# Altium project FPGA_Dev_Board.PrjPcb
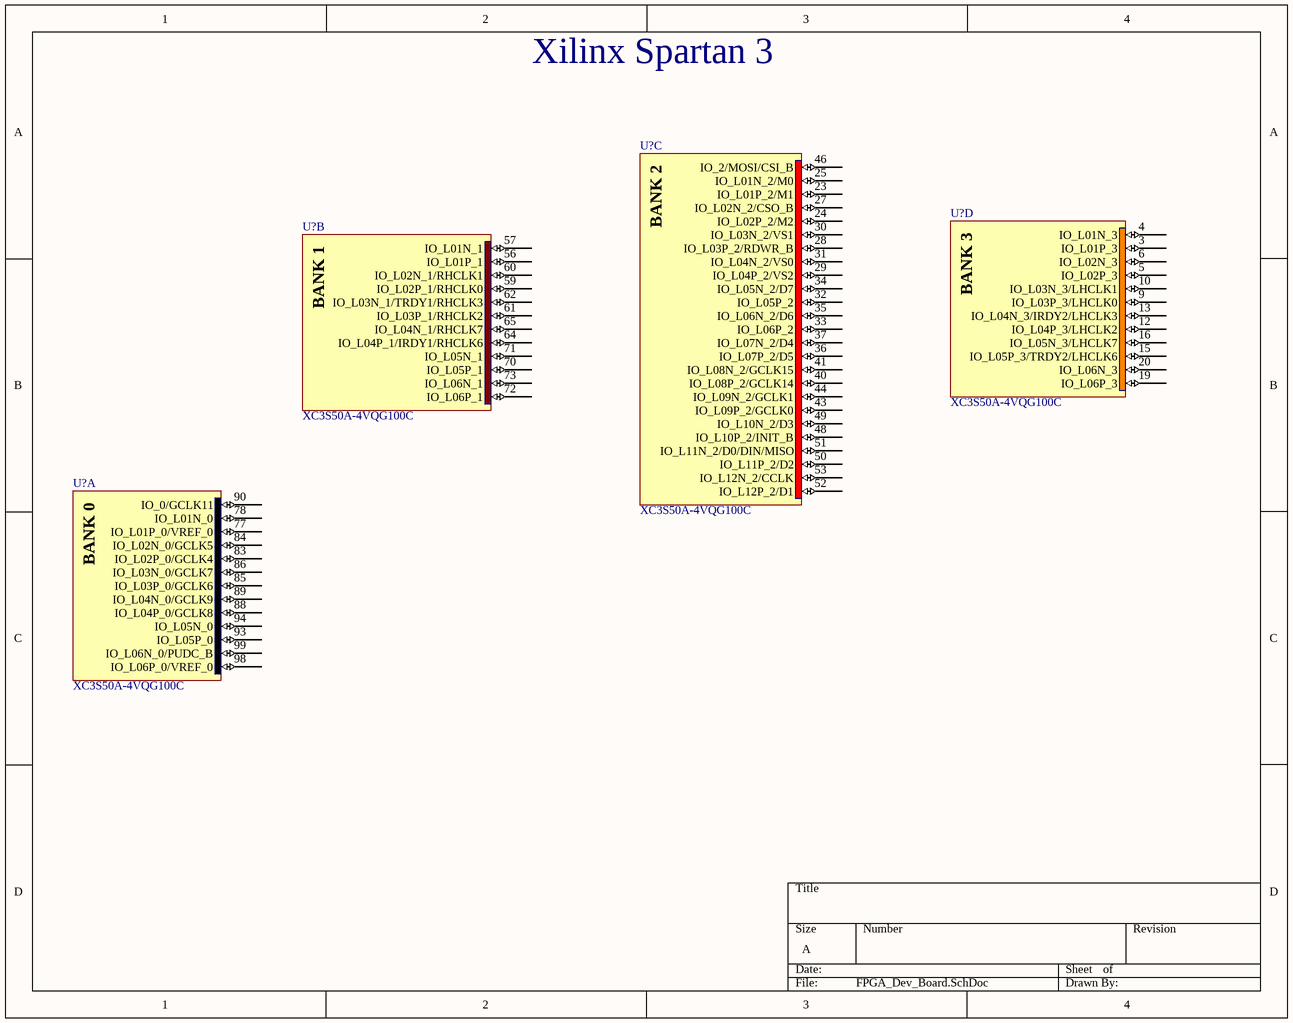
[diagram p0: FPGA_Dev_Board.SchDoc]
7 sheets, 34 parts. Net scope: global (net labels, ports and power ports of the same name join across sheets).
Sheets:
  Block Diagram.SchDoc
  FPGA_Dev_Board.SchDoc
  Peripherals.SchDoc
  SPI Flash.SchDoc
  PMICs.SchDoc
  Sensors.SchDoc
  DRAM.SchDoc

## Sheet Block Diagram.SchDoc
size A; SheetNumber: 1; SheetTotal: 8

## Sheet FPGA_Dev_Board.SchDoc
size A; SheetNumber: 2; SheetTotal: 8

### Parts
(Parts that share a designator on the sheet are numbered #1, #2 ... from top to bottom, then left to right.)
U?#1  XC3S50A-4VQG100C  [VQG100_N]  (part C of 8)
U?#2  XC3S50A-4VQG100C  [VQG100_N]  (part D of 8)
U?#3  XC3S50A-4VQG100C  [VQG100_N]  (part B of 8)
U?#4  XC3S50A-4VQG100C  [VQG100_N]  (part A of 8)

### Nets

Not connected (* = marked no-connect by the designer): U?#1 23(IO_L01P_2/M1) 24(IO_L02P_2/M2) 25(IO_L01N_2/M0) 27(IO_L02N_2/CSO_B) 28(IO_L03P_2/RDWR_B) 29(IO_L04P_2/VS2) 30(IO_L03N_2/VS1) 31(IO_L04N_2/VS0) 32(IO_L05P_2) 33(IO_L06P_2) 34(IO_L05N_2/D7) 35(IO_L06N_2/D6) 36(IO_L07P_2/D5) 37(IO_L07N_2/D4) 40(IO_L08P_2/GCLK14) 41(IO_L08N_2/GCLK15) 43(IO_L09P_2/GCLK0) 44(IO_L09N_2/GCLK1) 46(IO_2/MOSI/CSI_B) 48(IO_L10P_2/INIT_B) 49(IO_L10N_2/D3) 50(IO_L11P_2/D2) 51(IO_L11N_2/D0/DIN/MISO) 52(IO_L12P_2/D1) 53(IO_L12N_2/CCLK); U?#2 3(IO_L01P_3) 4(IO_L01N_3) 5(IO_L02P_3) 6(IO_L02N_3) 9(IO_L03P_3/LHCLK0) 10(IO_L03N_3/LHCLK1) 12(IO_L04P_3/LHCLK2) 13(IO_L04N_3/IRDY2/LHCLK3) 15(IO_L05P_3/TRDY2/LHCLK6) 16(IO_L05N_3/LHCLK7) 19(IO_L06P_3) 20(IO_L06N_3); U?#3 56(IO_L01P_1) 57(IO_L01N_1) 59(IO_L02P_1/RHCLK0) 60(IO_L02N_1/RHCLK1) 61(IO_L03P_1/RHCLK2) 62(IO_L03N_1/TRDY1/RHCLK3) 64(IO_L04P_1/IRDY1/RHCLK6) 65(IO_L04N_1/RHCLK7) 70(IO_L05P_1) 71(IO_L05N_1) 72(IO_L06P_1) 73(IO_L06N_1); U?#4 77(IO_L01P_0/VREF_0) 78(IO_L01N_0) 83(IO_L02P_0/GCLK4) 84(IO_L02N_0/GCLK5) 85(IO_L03P_0/GCLK6) 86(IO_L03N_0/GCLK7) 88(IO_L04P_0/GCLK8) 89(IO_L04N_0/GCLK9) 90(IO_0/GCLK11) 93(IO_L05P_0) 94(IO_L05N_0) 98(IO_L06P_0/VREF_0) 99(IO_L06N_0/PUDC_B)

### Notes on the sheet
- Xilinx Spartan 3
- (in symbol CMP-0049-00079-1, part A) BANK 0
- (in symbol CMP-0049-00079-1, part B) BANK 1
- (in symbol CMP-0049-00079-1, part C) BANK 2
- (in symbol CMP-0049-00079-1, part D) BANK 3

### Library data of the parts
U?#1-U?#4 = CMP-0049-00079-1: Spartan-3A I/O Optimized FPGA, 68 User I/Os, 100-Pin VQFP, Standard Performance, Commercial Grade, Pb-Free; PackageReference: VQG100; DatasheetVersion: ver1.8, Mar-2009; PackageDescription: 100-Pin Very Thin Quad Flat Pack (VQG100) - Pb-Free; PackageVersion: ver1.2.1, Feb-2007; Code_JEDEC: MS-026-AED

## Sheet Peripherals.SchDoc
size A; SheetNumber: 4; SheetTotal: 8

## Sheet SPI Flash.SchDoc
size A; SheetNumber: 4; SheetTotal: 7
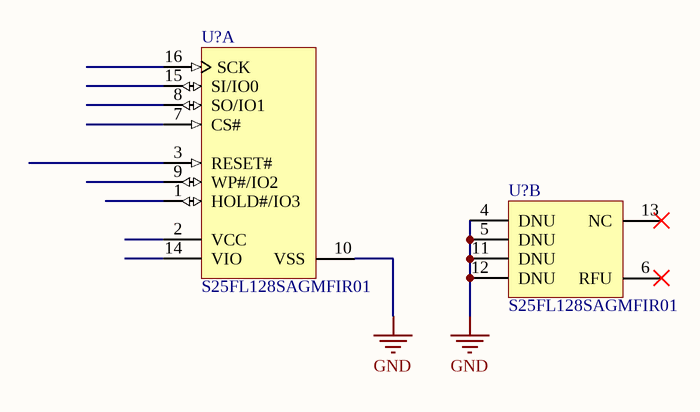
[diagram p1: SPI Flash.SchDoc]

### Parts
(Parts that share a designator on the sheet are numbered #1, #2 ... from top to bottom, then left to right.)
U?#5  S25FL128SAGMFIR01  [SPSN-SOIC-16_N]  (part A of 2)
U?#6  S25FL128SAGMFIR01  [SPSN-SOIC-16_N]  (part B of 2)

### Nets
GND: U?#5.10(VSS) U?#6.4(DNU) U?#6.5(DNU) U?#6.11(DNU) U?#6.12(DNU)

Not connected (* = marked no-connect by the designer): U?#5 1(HOLD#/IO3) 2(VCC) 3(RESET#) 7(CS#) 8(SO/IO1) 9(WP#/IO2) 14(VIO) 15(SI/IO0) 16(SCK); U?#6 6(RFU)* 13(NC)*

### Library data of the parts
U?#5 U?#6 = CMP-1329-00021-1: MirrorBit Flash Non-Volatile Memory CMOS 3.0 Volt Core with Versatile I/O, Serial Peripheral Interface with Multi-I/O, 128 Mbit, 133 MHz, -40 to 85 degC, 16-Pin SO (SO3016), RoHS, Tube; Manufacturer: Spansion; OTP: 1024 B; VCC: 2.7 to 3.6 V; Speed: 133 MHz; PackageDescription: 16-Pin Wide Plastic Small Outline Package, Body 10.3 x 7.5 mm, Pitch 1.27 mm; ComponentLink2URL: http://www.spansion.com/Support/Datasheets/S25FL128S_256S_00.pdf; PartNumber: S25FL128SAGMFIR01; Packing: Tube; Density: 128 Mbit; Temperature Range: -40 to 85 degC; Mounting Technology: Surface Mount; RoHS: TRUE; DatasheetVersion: Rev. 08; ComponentLink2Description: Datasheet; ComponentLink3URL: http://www.spansion.com/Support/Datasheets/S25FL128S_256S_00.pdf; ComponentLink1Description: Manufacturer URL; ComponentLink1URL: http://www.spansion.com/Pages/Default.aspx; ComponentLink3Description: Package Specification

## Sheet PMICs.SchDoc
size A; SheetNumber: 5; SheetTotal: 7
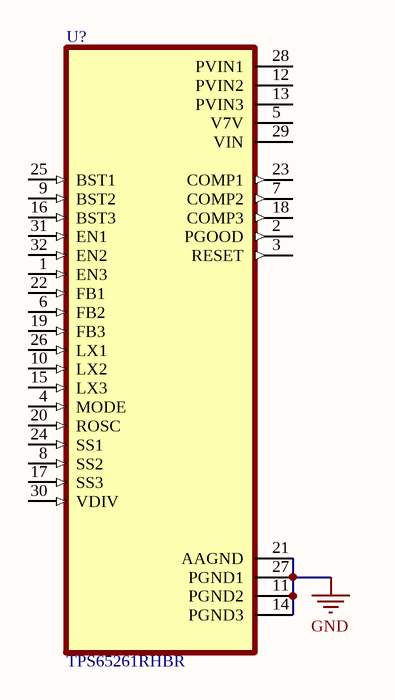
[diagram p2: PMICs.SchDoc]

### Parts
(Parts that share a designator on the sheet are numbered #1, #2 ... from top to bottom, then left to right.)
U?#7  TPS65261RHBR  [IC_ADS125H01IRHBT]

### Nets
GND: U?#7.11(PGND2) U?#7.14(PGND3) U?#7.21(AAGND) U?#7.27(PGND1)

Not connected (* = marked no-connect by the designer): U?#7 1(EN3) 2(PGOOD) 3(RESET) 4(MODE) 5(V7V) 6(FB2) 7(COMP2) 8(SS2) 9(BST2) 10(LX2) 12(PVIN2) 13(PVIN3) 15(LX3) 16(BST3) 17(SS3) 18(COMP3) 19(FB3) 20(ROSC) 22(FB1) 23(COMP1) 24(SS1) 25(BST1) 26(LX1) 28(PVIN1) 29(VIN) 30(VDIV) 31(EN1) 32(EN2)

### Library data of the parts
U?#7 = TPS65261RHBR: 4.5V to 18V Input Voltage, 3A/2A/2A Output Current Triple Synchronous Buck Converter 32-VQFN -40 to 85; MF: Texas Instruments; MP: TPS65261RHBR; Purchase-URL: https://pricing.snapeda.com/search/part/TPS65261RHBR/?ref=eda; Value: *; SnapEDA_Link: https://www.snapeda.com/parts/TPS65261RHBR/Texas%20Instruments/view-part/481678/?ref=snap; Price: None; Package: VQFN-32 Texas Instruments; Check_prices: https://www.snapeda.com/parts/TPS65261RHBR/Texas%20Instruments/view-part/481678/?ref=eda; Availability: Good

## Sheet Sensors.SchDoc
size A; SheetNumber: 6; SheetTotal: 7
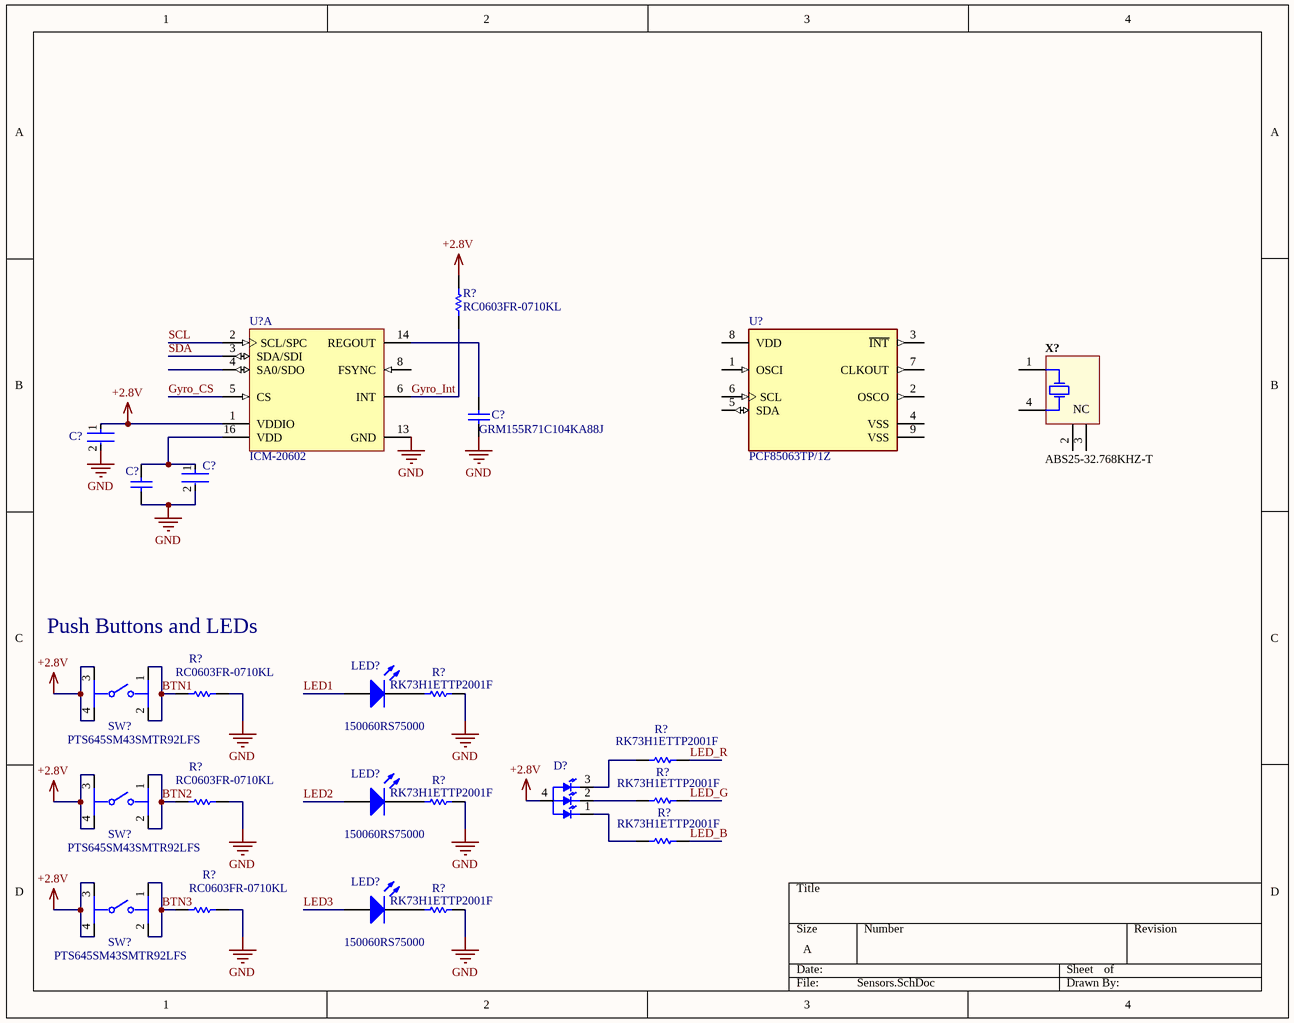
[diagram p3: Sensors.SchDoc]

### Parts
(Parts that share a designator on the sheet are numbered #1, #2 ... from top to bottom, then left to right.)
C?#1  CL10A225KO8NNNC  [FP-CL10-IPC_A]  (value not drawn)
C?#2  GRM155R71C104KA88J  [CAPC1005X55X25LL05T10]
C?#3  CL10A225KO8NNNC  [FP-CL10-IPC_A]  (value not drawn)
C?#4  GRM155R71C104KA88J  [CAPC1005X55X25LL05T10]  (value not drawn)
D?  UHD1110-FKA-CL1A13R3Q1BBQFMF3  [LED_UHD1110-FKA-CL1A13R3Q1BBQFMF3]  (value not drawn)
LED?#1  150060RS75000  [0603_A]
LED?#2  150060RS75000  [0603_A]
LED?#3  150060RS75000  [0603_A]
R?#1  RC0603FR-0710KL  [RESC1608X55X25ML10T15]
R?#2  RK73H1ETTP2001F  [RESC1005X40X25LL10T10]
R?#3  RC0603FR-0710KL  [RESC1608X55X25ML10T15]
R?#4  RK73H1ETTP2001F  [RESC1005X40X25LL10T10]
R?#5  RK73H1ETTP2001F  [RESC1005X40X25LL10T10]
R?#6  RK73H1ETTP2001F  [RESC1005X40X25LL10T10]
R?#7  RC0603FR-0710KL  [RESC1608X55X25ML10T15]
R?#8  RK73H1ETTP2001F  [RESC1005X40X25LL10T10]
R?#9  RK73H1ETTP2001F  [RESC1005X40X25LL10T10]
R?#10  RC0603FR-0710KL  [RESC1608X55X25ML10T15]
SW?#1  PTS645SM43SMTR92LFS  [FP-PTS645SM43SMTR92LFS-MFG]
SW?#2  PTS645SM43SMTR92LFS  [FP-PTS645SM43SMTR92LFS-MFG]
SW?#3  PTS645SM43SMTR92LFS  [FP-PTS645SM43SMTR92LFS-MFG]
U?#8  ICM-20602  [INSE-I62-16]  (part A of 2)
U?#9  PCF85063TP/1Z  [FP-SOT1069-2-MFG]
X?  ABS25-32.768KHZ-T  [ABRA-ABS25-4_V]

### Nets
+2.8V: C?#1.1 D?.4(ANODE) R?#1.2 SW?#1.3 SW?#1.4 SW?#2.3 SW?#2.4 SW?#3.3 SW?#3.4 U?#8.1(VDDIO)
GND: C?#1.2 C?#2.1 C?#3.2 C?#4.1 R?#2.2 R?#3.2 R?#5.2 R?#7.2 R?#9.2 R?#10.2 U?#8.13(GND)
BTN1: R?#3.1 SW?#1.1 SW?#1.2
BTN2: R?#7.1 SW?#2.1 SW?#2.2
BTN3: R?#10.1 SW?#3.1 SW?#3.2
Gyro_CS: U?#8.5(CS)
Gyro_Int: R?#1.1 U?#8.6(INT)
LED1: LED?#1.2(A)
LED2: LED?#2.2(A)
LED3: LED?#3.2(A)
LED_B: R?#8.2
LED_G: R?#6.2
LED_R: R?#4.2
SCL: U?#8.2(SCL/SPC)
SDA: U?#8.3(SDA/SDI)
NetC?#2_2: C?#2.2 U?#8.14(REGOUT)
NetC?#3_1: C?#3.1 C?#4.2 U?#8.16(VDD)
NetD?_1: D?.1(BLUE) R?#8.1
NetD?_2: D?.2(GREEN) R?#6.1
NetD?_3: D?.3(RED) R?#4.1
NetLED?#1_1: LED?#1.1(K) R?#2.1
NetLED?#2_1: LED?#2.1(K) R?#5.1
NetLED?#3_1: LED?#3.1(K) R?#9.1

Not connected (* = marked no-connect by the designer): U?#8 4(SA0/SDO) 8(FSYNC); U?#9 1(OSCI) 2(OSCO) 3(~{INT}) 4(VSS) 5(SDA) 6(SCL) 7(CLKOUT) 8(VDD) 9(VSS); X? 1(X1) 2(NC) 3(NC) 4(X2)

### Notes on the sheet
- Push Buttons and LEDs

### Library data of the parts
C?#1 C?#3 = CMP-13271-000835-1: Cap Ceramic 2.2uF 16V X5R ±10% Pad SMD 0603 +85°C T/R; Case Code (Metric): 1608; Height: 0.8mm; Case/Package: 0603; Depth: 0.8mm; Capacitance: 2.2uF; Voltage Rating: 16V; Case Code (Imperial): 0603; Length: 1.6mm; Packaging: Tape and Reel; Material: Ceramic; Lead Free: Lead Free; Max Operating Temperature: 85°C; Contact Plating: Tin; Thickness: 0.035inch; Radiation Hardening: No; Tolerance: 10%; Min Operating Temperature: -55°C; Voltage: 16V; Dielectric: X5R; Mount: Surface Mount; Package Quantity: 4000; Width: 0.031inch; Voltage Rating (DC): 16V
C?#2 C?#4 = CMP-2008-03928-1: Manufacturer: Murata; Part Number: GRM155R71C104KA88J
D? = UHD1110-FKA-CL1A13R3Q1BBQFMF3: Red, Green, Blue _RGB_ LED Indication - Discrete 1.9V Red, 2.9V Green, 2.9V Blue 0404 _1010 Metric_; MF: Cree Inc.; Price: None; Package: 0404 Cree Inc.; SnapEDA_Link: https://www.snapeda.com/parts/UHD1110-FKA-CL1A13R3Q1BBQFMF3/Cree%20Inc./view-part/2684282/?ref=snap; Value: *; MP: UHD1110-FKA-CL1A13R3Q1BBQFMF3; Availability: Unavailable
LED?#1-LED?#3 = CMP-1426-00001-1: SMD mono-color Chip LED, WL-SMCW, Red; Manufacturer: Wuerth Elektronik; Color: Red; PackageReference: 0603_A; ComponentLink2URL: http://katalog.we-online.com/led/datasheet/150060RS75000.pdf; ComponentLink1URL: http://www.we-online.com; ComponentLink1Description: Manufacturer URL; ComponentLink2Description: Datasheet; PartNumber: 150060RS75000
R?#1 R?#3 R?#7 R?#10 = CMP-2100-03664-1: Chip Resistor, 10 KOhm, +/- 1%, 01 W, -55 to 155 degC, 0603 (1608 Metric), RoHS, Tape and Reel; Manufacturer: Yageo; Temperature Coefficient: 100ppm/degreesC; Resistance: 10KOhm; Voltage Rating: 75V; Power Rating: 100mW; Voltage Rating (DC): 50V; Composition: ThickFilm; RoHSCompliant: true; Height: 0.45mm; Lead Free: LeadFree; Case Code (Metric): 1608; Case/Package: 0603; Datasheet Version: Rev. 5, 10/2016; Package Reference: 0603; Depth: 0.8mm; Package Description: 2-Pin Surface Mount Device, Body 1.6 x 0.8 mm; Case Code (Imperial): 0603; Packaging: TapeandReel; Termination: SMD/SMT; Lead Pitch: 0.3mm; Width: 0.8mm; Number of Pins: 2; Length: 1.6mm; REACH SVHC: NoSVHC; Military Standard: Not; Max Operating Temperature: 155degC; Min Operating Temperature: -55degC; Manufacturer URL: http://www.yageo.com/; Datasheet URL: http://www.yageo.com/NewPortal/yageodocoutput?fileName=/pdf/R-Chip/PYu-RC_Group_51_RoHS_L_5.pdf; Weight: 7.1E-05oz; Tolerance: 1%
R?#2 R?#4-R?#6 R?#8 R?#9 = CMP-2002-04283-1: Manufacturer: KOA Speer; Part Number: RK73H1ETTP2001F
SW?#1-SW?#3 = CMP-2000-05160-2: SWITCH TACTILE SPST-NO 0.05A 12V; Contact Resistance: 100mR; Throw Configuration: SPST; Illumination Type: Non-Illuminated; Mechanical Life: 100000Cycles; Current Rating: 50mA; Switch Function: Off-Mom; Actuator Length: 0.85mm; Actuator Material: Nylon; Actuator Type: Standard; Operating Force: 160gf; Min Operating Temperature: -20°C; REACH SVHC: No SVHC; Termination: Gull Wing; Case/Package: SMD/SMT; Packaging: Tape and Reel; Mount: Surface Mount; Voltage Rating (DC): 12V; Orientation: Straight; Lead Free: Lead Free; Contact Material: Silver; Color: Black; Max Current Rating: 50mA; Contact Plating: Silver; Depth: 9mm; Package Quantity: 1; Max Voltage Rating (DC): 12V; Length: 6mm; Max Operating Temperature: 60°C
U?#8 = CMP-2000-07589-1: High Performance 6-Axis MEMS MotionTracking(TM) Device, 1.71 to 3.45 V, -40 to 85 degC, 16-Pin LGA, RoHS; Manufacturer: InvenSense; Sensor Type: Temperature; Output Type: I2C; RoHSCompliant: True; Datasheet Version: Rev. 1.0, 10/2016; Datasheet URL: http://www.invensense.com/wp-content/uploads/2016/10/DS-000176-ICM-20602-v1.0.pdf; Min Operating Temperature: -40degC; Mounting Technology: SurfaceMount; Max Operating Temperature: 85degC; Manufacturer URL: http://www.invensense.com/; Package Reference: I62-16; Package Description: 16-Pin Land Grid Array, Body 3 x 3 mm, Pitch 0.5 mm
U?#9 = CMP-10083-000006-1: IC RTC CLK/CALENDAR I2C 8-SON; Manufacturer: NXP; Min Supply Voltage: 0.9V; Frequency: 400kHz; Max Supply Voltage: 5.5V; Standoff Height: 0mm; Number Of Outputs: 1; Nominal Supply Current: 0.22-18uA; ComponentLink2Description: Datasheet; Digikey Description: IC RTC CLK/CALENDAR I2C 8-SON; Mouser Description: Real Time Clock Low Power Real time clocks; Temperature Range High: +85°C; Category: IC; Ambient Temperature Range Low: -40°C; Device Class L3: Real Time Clocks; Ambient Temperature Range High: +85°C; Package: SOT1069-2; Temperature: -40°C to +85°C; Manufacturer Part Number: PCF85063TP/1Z; Interface: I2C; Height: 0.8mm; Octopart: https://octopart.com/pcf85063tp%2F1z-nxp+semiconductors-29857196; Device Class L2: Clock and Timing; Temperature Range Low: -40°C; Device Class L1: Integrated Circuits (ICs); Ipc Land Pattern Name: DFN200X300X75-8; Lead Free: Yes; ComponentLink2URL: https://www.nxp.com/docs/en/data-sheet/PCF85063TP.pdf; Automotive: No; Footprint Url: https://www.nxp.com/docs/en/package-information/SOT1069-2.pdf; RoHS: TRUE
X? = CMP-2000-05037-1: Low Frequency Crystal, 32.768 KHz, -40 to 85 degC, 4-Pin SMD, RoHS, Tape and Reel; Load Capacitance: 12.5pF; Tolerance: 20PPM; Brand: ABRACON; ESR: 50kOhms; Case Length: 8mm; Case Width: 3.8mm; Case Height: 2.5mm; RoHS: Details; Product Category: Crystals; Frequency: 32.768kHz; Datasheet Version: May-11; Series: ABS25; Datasheet URL: https://datasheet.ciiva.com/7998/1700987-7998663.pdf; Termination Style: SMD/SMT; Package Reference: ABS25; Dimensions: 3.8mmWx8mmLx2.5mmH; Package / Case: 8mmx3.8mm; Manufacturer: Abracon; Manufacturer URL: http://www.abracon.com/; Mounting Style: SMD/SMT; Package Description: 4-Pin Surface Mount Device, Body 8 x 3.8 mm, Pitch 5.5 mm; Operating Temperature Range: -40Cto+85C; Factory Pack Quantity: 1000; Type: LowFrequencyCrystal; Packaging: Reel

## Sheet DRAM.SchDoc
size A; SheetNumber: 7; SheetTotal: 7
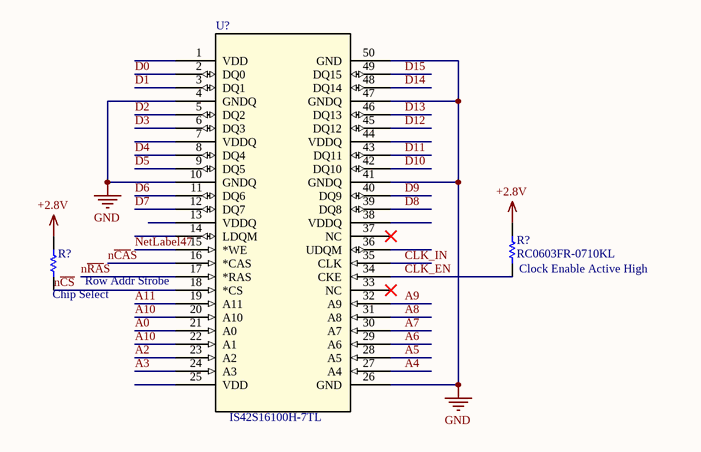
[diagram p4: DRAM.SchDoc]

### Parts
(Parts that share a designator on the sheet are numbered #1, #2 ... from top to bottom, then left to right.)
R?#11  RC0603FR-0710KL  [RESC1608X55X25ML10T15]
R?#12  RC0603FR-0710KL  [RESC1608X55X25ML10T15]  (value not drawn)
U?#10  IS42S16100H-7TL  [TSOPII_50L_400MIL_ISI]

### Nets
+2.8V: R?#11.2 R?#12.2
GND: U?#10.4(GNDQ) U?#10.10(GNDQ) U?#10.26(GND) U?#10.41(GNDQ) U?#10.47(GNDQ) U?#10.50(GND)
A0: U?#10.21(A0)
A2: U?#10.23(A2)
A3: U?#10.24(A3)
A4: U?#10.27(A4)
A5: U?#10.28(A5)
A6: U?#10.29(A6)
A7: U?#10.30(A7)
A8: U?#10.31(A8)
A9: U?#10.32(A9)
A10: U?#10.20(A10) U?#10.22(A1)
A11: U?#10.19(A11)
CLK_EN: R?#11.1 U?#10.34(CKE)
CLK_IN: U?#10.35(CLK)
D0: U?#10.2(DQ0)
D1: U?#10.3(DQ1)
D2: U?#10.5(DQ2)
D3: U?#10.6(DQ3)
D4: U?#10.8(DQ4)
D5: U?#10.9(DQ5)
D6: U?#10.11(DQ6)
D7: U?#10.12(DQ7)
D8: U?#10.39(DQ8)
D9: U?#10.40(DQ9)
D10: U?#10.42(DQ10)
D11: U?#10.43(DQ11)
D12: U?#10.45(DQ12)
D13: U?#10.46(DQ13)
D14: U?#10.48(DQ14)
D15: U?#10.49(DQ15)
n~{CA}S: U?#10.16(*CAS)
n~{CS}: R?#12.1 U?#10.18(*CS)
NetLabel47: U?#10.15(*WE)
n~{RA}S: U?#10.17(*RAS)

Not connected (* = marked no-connect by the designer): U?#10 1(VDD) 7(VDDQ) 13(VDDQ) 14(LDQM) 25(VDD) 33(NC)* 36(UDQM) 37(NC)* 38(VDDQ) 44(VDDQ)

### Notes on the sheet
- (near R?#12) Chip Select
- Row Addr Strobe
- (near R?#11) Clock Enable Active High

### Library data of the parts
R?#11 R?#12 = CMP-2100-03664-1: as R?#1 on sheet Sensors; Composition: ThickFilm; RoHSCompliant: true; Height: 0.45mm; Lead Free: LeadFree; Case Code (Metric): 1608; Case/Package: 0603; Datasheet Version: Rev. 5, 10/2016; Package Reference: 0603; Depth: 0.8mm; Package Description: 2-Pin Surface Mount Device, Body 1.6 x 0.8 mm; Case Code (Imperial): 0603; Packaging: TapeandReel; Termination: SMD/SMT; Lead Pitch: 0.3mm; Width: 0.8mm; Number of Pins: 2; Length: 1.6mm; REACH SVHC: NoSVHC; Military Standard: Not; Max Operating Temperature: 155degC; Min Operating Temperature: -55degC; Manufacturer URL: http://www.yageo.com/; Datasheet URL: http://www.yageo.com/NewPortal/yageodocoutput?fileName=/pdf/R-Chip/PYu-RC_Group_51_RoHS_L_5.pdf; Weight: 7.1E-05oz; Tolerance: 1%
U?#10 = IS42S16100H-7TL: No Description Available; Vendor: ISSI; Built_By: EMA_Cory; SourceLibrary: ISSI_2020-05-21; Datasheet: http://www.issi.com/WW/pdf/42-45S16100H.pdf; Manufacturer_Part_Number: IS42S16100H-7TL; Copyright: Copyright (C) 2018 Accelerated Designs. All rights reserved; RefDes: RefDes; Type: DEV

## Nets that join several sheets
+2.8V: Sensors (10 pins), DRAM (R?#11.2 R?#12.2)
GND: SPI Flash (5 pins), PMICs (U?#7.11 U?#7.14 U?#7.21 U?#7.27), Sensors (11 pins), DRAM (6 pins)